# Altium schematic sheet LCD1602液晶显示.SchDoc
size A4
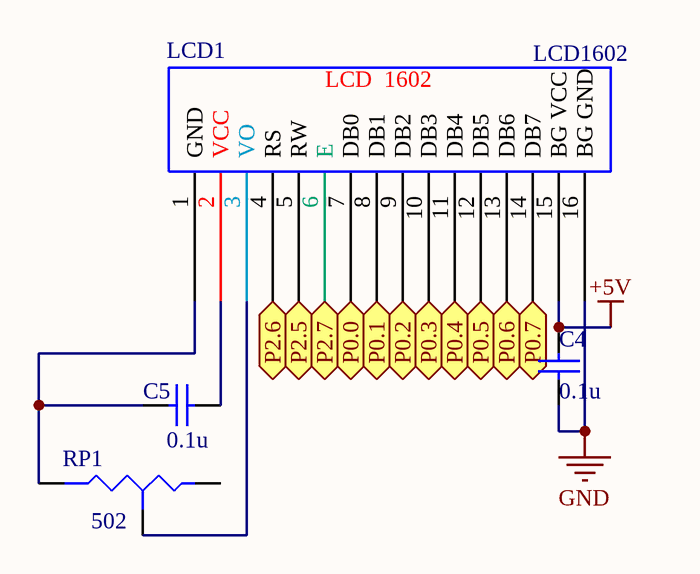
[diagram p0: LCD1602液晶显示.SchDoc]

## Parts
C4  瓷片电容  [瓷片电容]  (value not drawn)
C5  瓷片电容  [瓷片电容]  (value not drawn)
LCD1  LCD1602  [SIP16]
RP1  滑阻  [三脚滑阻]  (value not drawn)

## Ports
P0.0, P0.1, P0.2, P0.3, P0.4, P0.5, P0.6, P0.7, P2.5, P2.6, P2.7

## Nets
+5V: C4.1 LCD1.15(BG_VCC)
GND: C4.2 LCD1.16(BG_GND)
P0.0: LCD1.7(DB0) ; port P0.0
P0.1: LCD1.8(DB1) ; port P0.1
P0.2: LCD1.9(DB2) ; port P0.2
P0.3: LCD1.10(DB3) ; port P0.3
P0.4: LCD1.11(DB4) ; port P0.4
P0.5: LCD1.12(DB5) ; port P0.5
P0.6: LCD1.13(DB6) ; port P0.6
P0.7: LCD1.14(DB7) ; port P0.7
P2.5: LCD1.5(RW) ; port P2.5
P2.6: LCD1.4(RS) ; port P2.6
P2.7: LCD1.6(E) ; port P2.7
NetC5_1: C5.1 LCD1.2(VCC)
NetC5_2: C5.2 LCD1.1(GND) RP1.3(B)
NetLCD1_3: LCD1.3(VO) RP1.2(TAP)

Not connected (* = marked no-connect by the designer): RP1 1(A)

## Notes on the sheet
- 标题
- 日期
- 红外数字模拟接收一体机
- 2015 5 29
- 作者
- 模电组
- 单位
- 电子技术协会
- (in symbol LCD1602) LCD  1602
- (in symbol 滑阻) 502
- (in symbol 瓷片电容) 0.1u